# Altium schematic sheet auto-discharge.SchDoc
size A; SheetNumber: 5
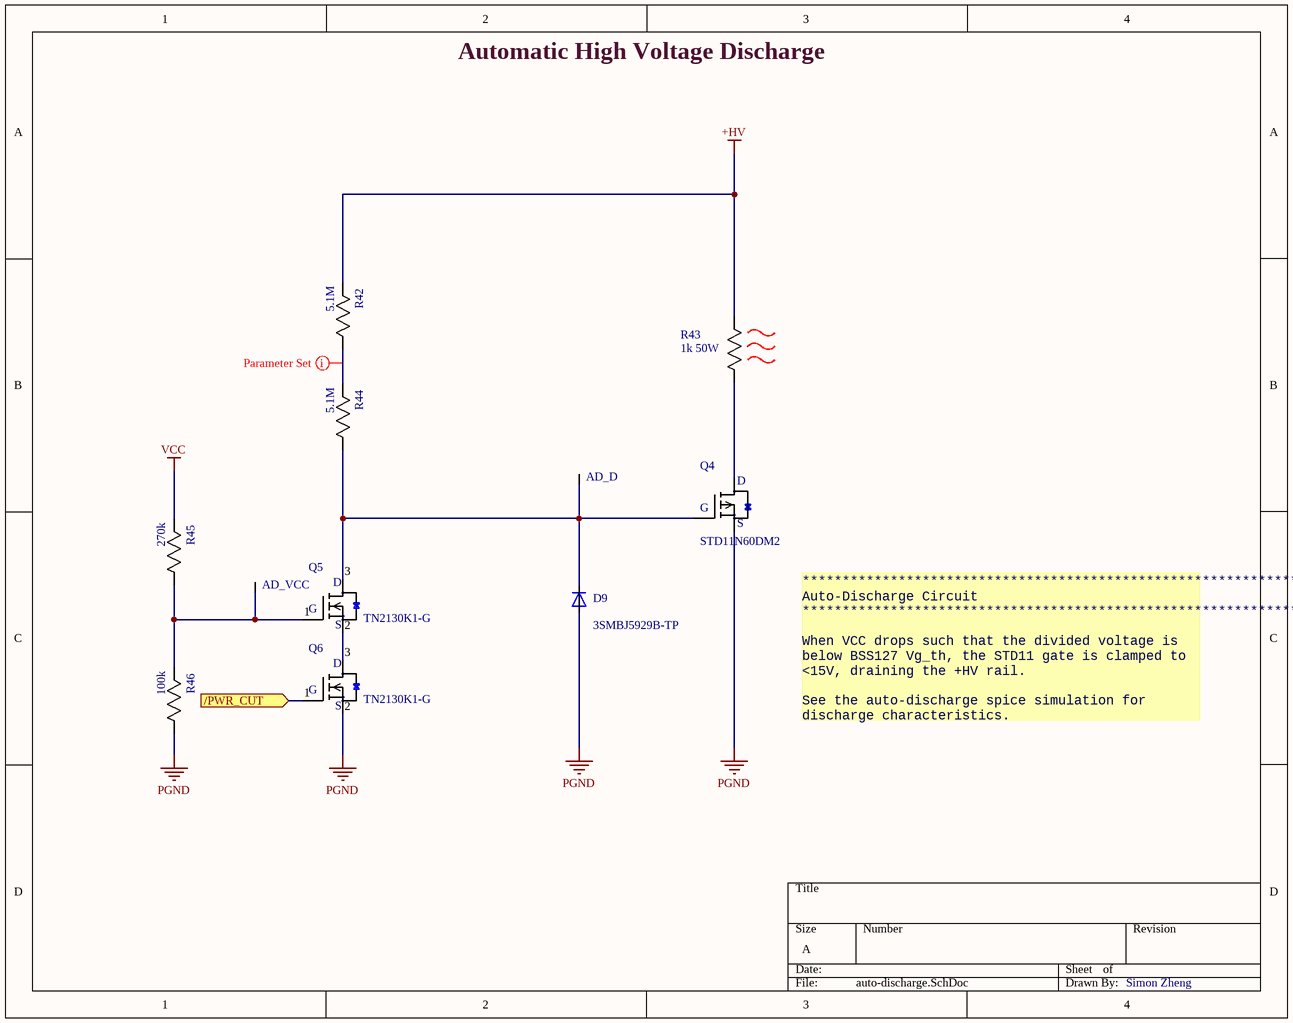
[diagram p0: auto-discharge.SchDoc]

## Parts
AD_D  Test Point (Via)  [TP]  (value not drawn)
AD_VCC  Test Point (Via)  [TP]  (value not drawn)
D9  3SMBJ5929B-TP  [DO-214AA]
Q4  STD11N60DM2  [DPAK (TO-252)]
Q5  TN2130K1-G  [SOT95P237X112-3N]
Q6  TN2130K1-G  [SOT95P237X112-3N]
R42  5.1M  [0603]
R43  1k 50W  [D2PAK (TO-263)]
R44  5.1M  [0603]
R45  270k  [0603]
R46  100k  [0603]

## Ports
/PWR_CUT (in)

## Nets
+HV: R42.2(R2) R43.2(R2)
PGND: D9.A Q4.S Q6.2(S) R46.1(R1)
VCC: R45.2(R2)
/PWR_CUT: Q6.1(G) ; port /PWR_CUT
NetAD_D_1: AD_D.1 D9.C Q4.G Q5.3(D) R44.1(R1)
NetAD_VCC_1: AD_VCC.1 Q5.1(G) R45.1(R1) R46.2(R2)
NetQ4_D: Q4.D R43.1(R1)
NetQ5_2: Q5.2(S) Q6.3(D)
NetR42_1: R42.1(R1) R44.2(R2)

Not connected (* = marked no-connect by the designer): R43 3

## Layout directives
net class HighVoltage: NetR42_1

## Notes on the sheet
- Automatic High Voltage Discharge
- **********************************************************************
  Auto-Discharge Circuit
  **********************************************************************
  When VCC drops such that the divided voltage is below BSS127 Vg_th, the STD11 gate is clamped to <15V, draining the +HV rail.
  See the auto-discharge spice simulation for discharge characteristics.
- Simon Zheng

## Library data of the parts
D9 = DIODE ZENER 15V 3W: Supplier 1: Digi-Key; Supplier Part Number 1: 3SMBJ5929BTPMSCT-ND
Q4 = STD11N60DM2: pin to pad: D>2 G>1 S>3; MFG: STMicroelectronics; Supplier: Digikey; Supplier PN: 497-16925-1-ND
Q5 Q6 = MOSFET N-CH TN2130K1-G: N-Channel 300 V 85mA (Tj) 360mW (Tc) Surface Mount TO-236AB (SOT23); Mfr_Name: Microchip; Type: DEV; Copyright: Copyright (C) 2021 Ultra Librarian. All rights reserved.; Manufacturer_Part_Number: TN2130K1-G; Digi-Key_Part_Number_1: TN2130K1-GCT-ND; Digi-Key_Part_Number_2: TN2130K1-GDKR-ND; Digi-Key_Part_Number_3: TN2130K1-GTR-ND; RefDes: RefDes; Supplier 1: Digi-Key; Supplier Part Number 1: TN2130K1-GCT-ND
R42 R44 = RES 5.1M 1/8W-5%: RES SMD 5.1 MOHM 5% 1/8W 0805; Power (Watts): 0.125W; Package: 0805; Value: 5.1M; Tolerance: 5%
R43 = RES 1.5k 50W: RES SMD 1.5K OHM 1% 50W D2PAK; Package: D2PAK (TO-263); Value: 1.5k; Power (Watts): 50W; Tolerance: 1%
R45 = RES 270k 1/8W: RES SMD 270K OHM 5% 1/8W 0805/0603; Power (Watts): 0.125W; Package: 0805; Value: 270k; Tolerance: 5%
R46 = RES 100k 1/8W - 1%: RES SMD 100K OHM 1% 1/8W 0805/0603; Power (Watts): 0.125W; Package: 0805; Value: 100k; Tolerance: 1%